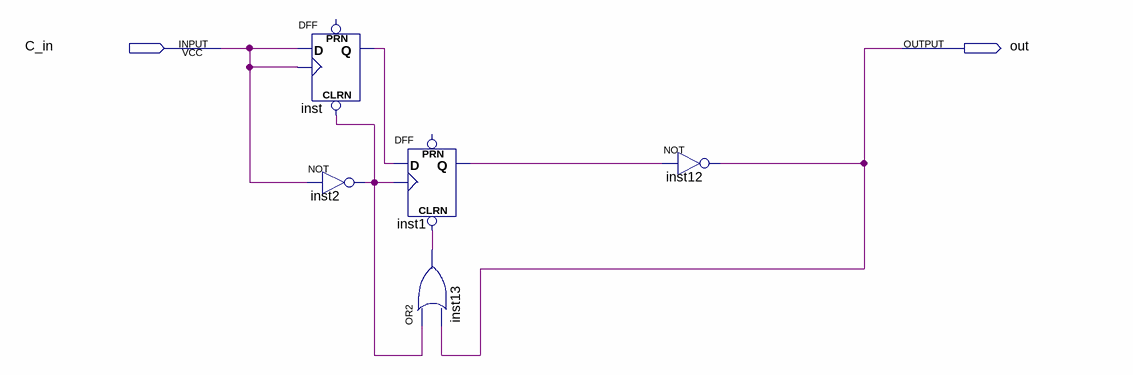
[diagram p0: schematic sheet]
// Quartus schematic test.bdf as structural Verilog: 5 symbols, 2 pins
module test (
  input  C_in,
  output out
);

  wire inst1_q, inst2_out, inst13_out, inst_q;

  DFF inst (.CLRN(inst2_out), .CLK(C_in), .D(C_in), .Q(inst_q));  // open: PRN
  not inst2 (inst2_out, C_in);
  DFF inst1 (.CLRN(inst13_out), .CLK(inst2_out), .D(inst_q), .Q(inst1_q));  // open: PRN
  or inst13 (inst13_out, inst2_out, out);
  not inst12 (out, inst1_q);
endmodule
